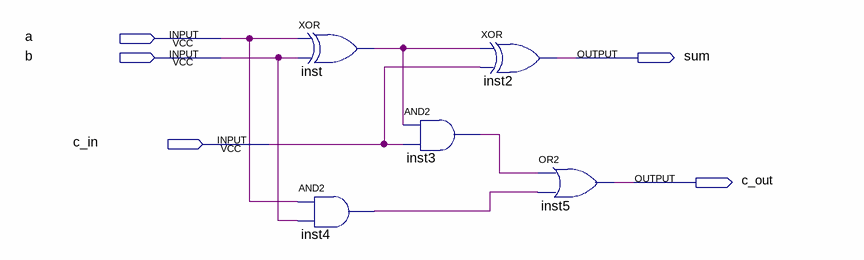
[diagram p0: schematic sheet]
// Quartus schematic full_adder_dg.bdf as structural Verilog: 5 symbols, 5 pins
module full_adder_dg (
  input  a,
  input  b,
  input  c_in,
  output sum,
  output c_out
);

  wire inst3_out, inst4_out, inst_out;

  xor inst (inst_out, a, b);
  and inst4 (inst4_out, a, b);
  and inst3 (inst3_out, inst_out, c_in);
  xor inst2 (sum, inst_out, c_in);
  or inst5 (c_out, inst3_out, inst4_out);
endmodule
